# Altium schematic sheet Control board. Page 4.SchDoc
size 420 x 297 mm; Address1: Address1; Address2: Address2; Address3: Address3; Address4: Address4; DocumentNumber: АБВГ.123456.001 Э3; SheetNumber: 4; SheetTotal: 4; Scale: 1:1; DocumentType: Схема электрическая принципиальная; FirstReferrence: АБВГ.123456.001
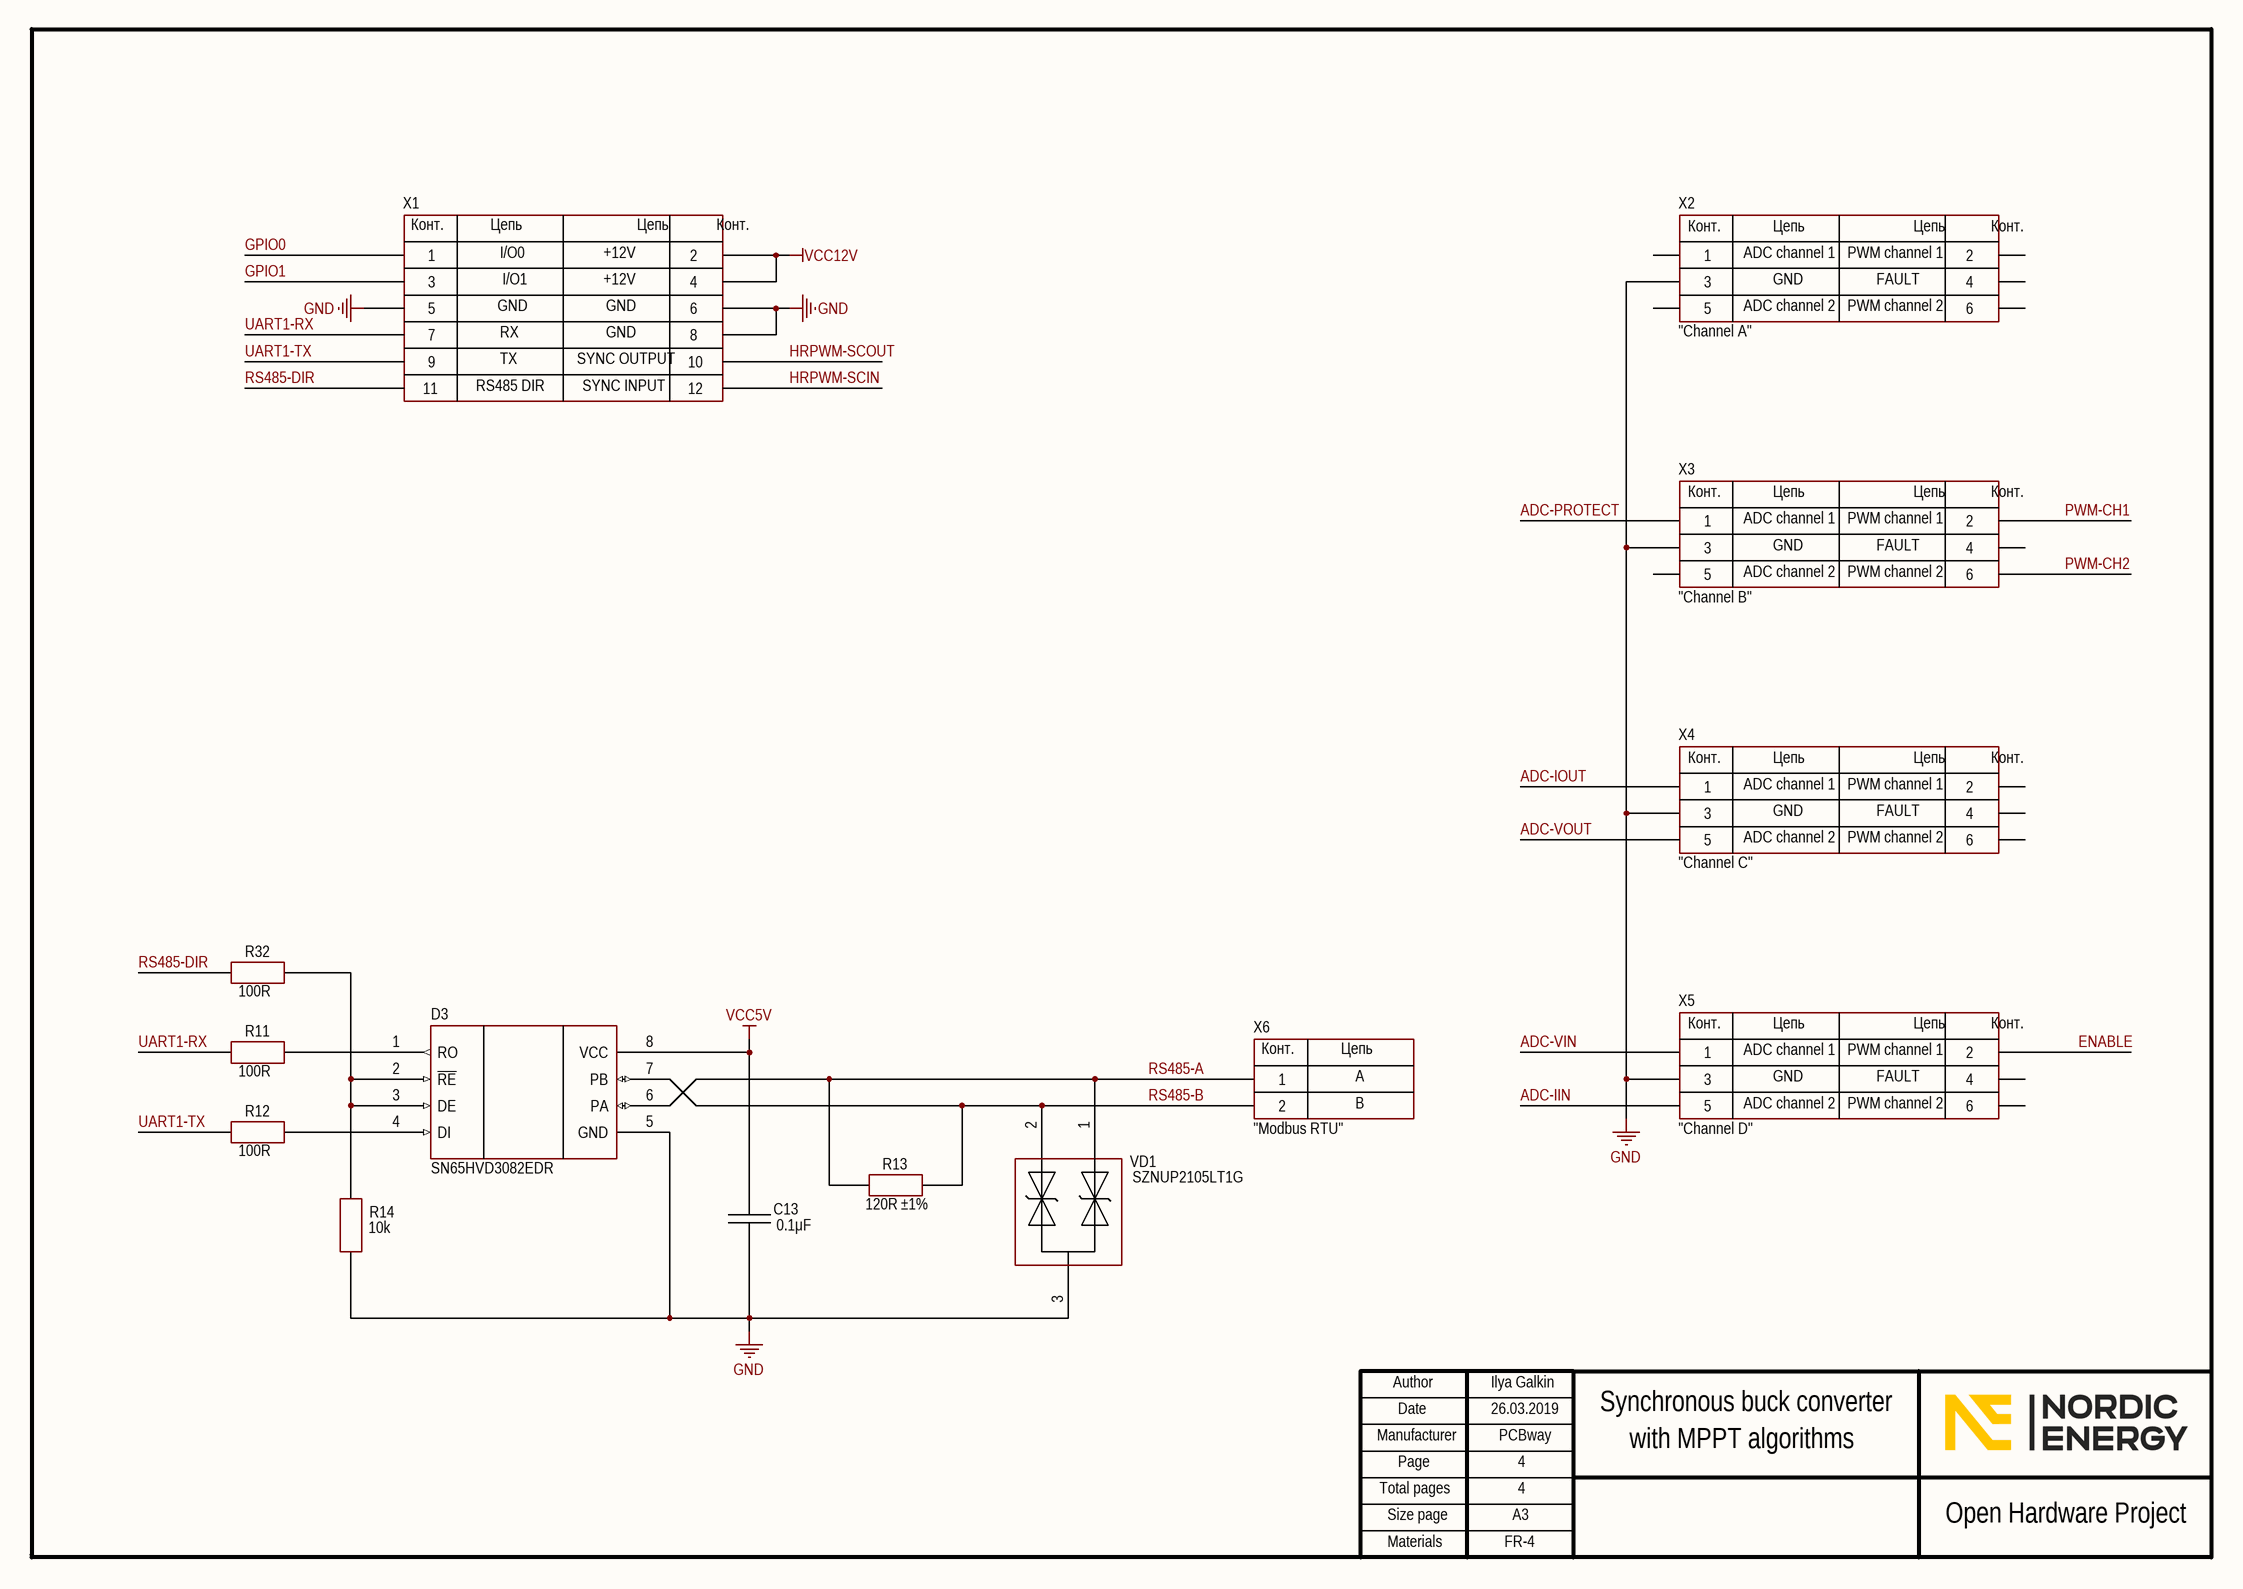
[diagram p0: Control board. Page 4.SchDoc]

## Parts
C13  0.1μF  [CH0805C]
D3  SN65HVD3082EDR  [8-SOIC]
R11  100R  [CH0805R]
R12  100R  [CH0805R]
R13  120R  ComponentKind: ±1%  [CH0805R]
R14  10k  [CH0805R]
R32  100R  [CH0805R]
VD1  SZNUP2105LT1G  [SOT23_132]
X1  *  [CON: PBD-12]  (value not drawn)
X2  "Channel A"  [CON: PBD-6]
X3  "Channel B"  [CON: PBD-6]
X4  "Channel C"  [CON: PBD-6]
X5  "Channel D"  [CON: PBD-6]
X6  "Modbus RTU"  [CON: 0395430002 (5 mm)]

## Nets
GND: C13.1 D3.5(GND) R14.1 VD1.3 X1.5 X1.6 X1.8 X2.3 X3.3 X4.3 X5.3
VCC5V: C13.2 D3.8(VCC)
VCC12V: X1.2 X1.4
ADC-IIN: X5.5
ADC-IOUT: X4.1
ADC-PROTECT: X3.1
ADC-VIN: X5.1
ADC-VOUT: X4.5
ENABLE: X5.2
GPIO0: X1.1
GPIO1: X1.3
HRPWM-SCIN: X1.12
HRPWM-SCOUT: X1.10
PWM-CH1: X3.2
PWM-CH2: X3.6
RS485-A: D3.6(PA) R13.1 VD1.1 X6.1
RS485-B: D3.7(PB) R13.2 VD1.2 X6.2
RS485-DIR: R32.2 X1.11
UART1-RX: R11.2 X1.7
UART1-TX: R12.2 X1.9
NetD3_1: D3.1(RO) R11.1
NetD3_2: D3.2(~{RE}) D3.3(DE) R14.2 R32.1
NetD3_4: D3.4(DI) R12.1

Not connected (* = marked no-connect by the designer): X2 1 2 4 5 6; X3 4 5; X4 2 4 6; X5 4 6

## Notes on the sheet
- (near X1) I/O0
- (near X1) +12V
- (near X2) ADC channel 1
- (near X2) PWM channel 1
- (near X1) GND
- (near X1) I/O1
- (near X2) ADC channel 2
- (near X2) GND
- (near X2) PWM channel 2
- (near X2) FAULT
- (near X1) RS485 DIR
- (near X1) TX
- (near X1) RX
- (near X1) SYNC OUTPUT
- (near X1) SYNC INPUT
- (near X3) ADC channel 1
- (near X3) PWM channel 1
- (near X3) ADC channel 2
- (near X3) GND
- (near X3) PWM channel 2
- (near X3) FAULT
- (near X4) ADC channel 1
- (near X4) PWM channel 1
- (near X4) ADC channel 2
- (near X4) GND
- (near X4) PWM channel 2
- (near X4) FAULT
- (near X5) ADC channel 1
- (near X5) PWM channel 1
- B
- A
- (near X5) ADC channel 2
- (near X5) GND
- (near X5) PWM channel 2
- (near X5) FAULT
- Ilya Galkin
- 26.03.2019
- PCBway
- 4
- Synchronous buck converter
- with MPPT algorithms
- FR-4
- Author
- Manufacturer
- Date
- Page
- Total pages
- Size page
- A3
- Open Hardware Project
- Materials
- (in symbol 2-Connector) Конт.; Цепь
- (in symbol 6(2)-Connector) Конт.; Цепь
- (in symbol 12-Connector (2)) Конт.; Цепь

## Library data of the parts
C13 = Capacitor: Manufacturer: Yageo; Model: CC0805KRX7R8BB104; HelpURL: https://www.digikey.com/product-detail/en/yageo/CC0805KRX7R8BB104/311-1141-1-ND/303051; ComponentKind: X7R; Value: 0.1μF
D3 = SN65HVD3082EDR: RS485; Manufacturer: Texas Instruments; Model: SN65HVD3082EDR; HelpURL: https://www.digikey.com/product-detail/en/texas-instruments/SN65HVD3082EDR/296-31719-1-ND/3505195; ComponentKind: 8-SOIC
R11 R12 R32 = Resistor: Manufacturer: Yageo; Model: RC0805JR-07100RL; HelpURL: https://www.digikey.com/product-detail/en/yageo/RC0805JR-07100RL/311-100ARCT-ND/731185; ComponentKind: ±5%; Value: 100R
R13 = Resistor: Manufacturer: Yageo; Model: RC0805FR-07120RL; HelpURL: https://www.digikey.com/product-detail/en/yageo/RC0805FR-07120RL/311-120CRCT-ND/730522; Value: 120R
R14 = Resistor: Manufacturer: Yageo; Model: RC0805JR-0710KL; HelpURL: https://www.digikey.com/product-detail/en/yageo/RC0805JR-0710KL/311-10KARCT-ND/731188; ComponentKind: ±5%; Value: 10k
VD1 = TVS Array: Manufacturer: ON Semiconductor; ComponentKind: 24V; Model: SZNUP2105LT1G; HelpURL: https://www.digikey.com/product-detail/en/on-semiconductor/SZNUP2105LT1G/SZNUP2105LT1GOSCT-ND/3487669
X1 = 12-Connector (2): Model: *; Manufacturer: *; HelpURL: *; ComponentKind: *
X2-X5 = 6(2)-Connector: Model: *; Manufacturer: *; HelpURL: *; ComponentKind: *
X6 = 2-Connector: Manufacturer: Molex; Model: 0395430002; HelpURL: https://www.digikey.com/products/en?keywords=0395430002; ComponentKind: 300V 10A